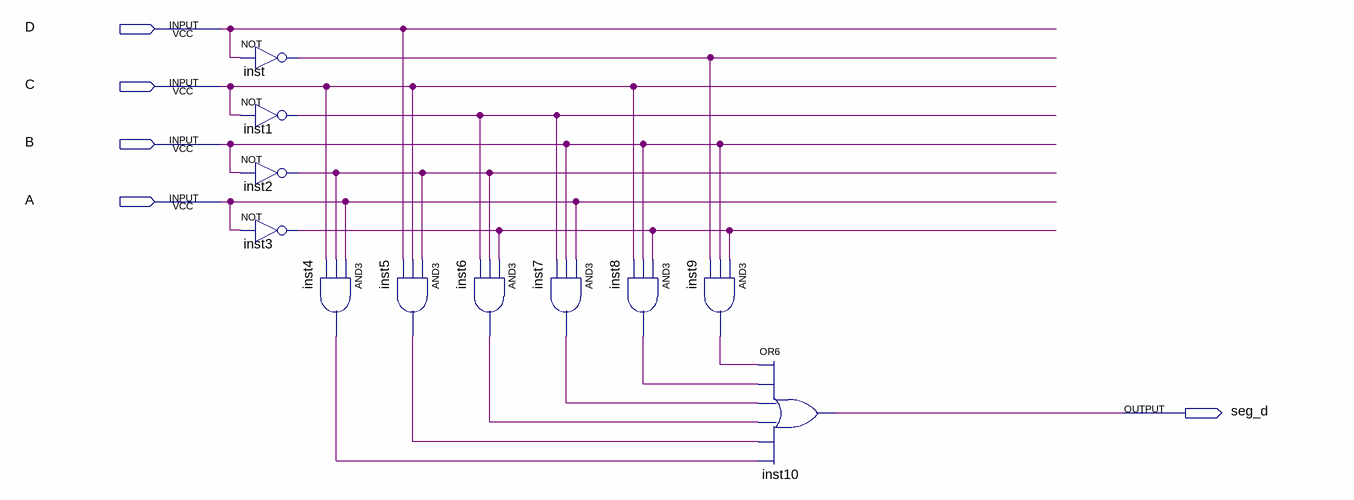
[diagram p0: schematic sheet]
// Quartus schematic seg_d.bdf as structural Verilog: 11 symbols, 5 pins
module seg_d (
  input  D,
  input  C,
  input  B,
  input  A,
  output seg_d
);

  wire inst1_out, inst2_out, inst3_out, inst4_out, inst5_out, inst6_out, inst7_out, inst8_out, inst9_out,
       inst_out;

  not inst (inst_out, D);
  not inst1 (inst1_out, C);
  not inst2 (inst2_out, B);
  not inst3 (inst3_out, A);
  and inst4 (inst4_out, A, inst2_out, C);
  and inst5 (inst5_out, inst2_out, C, D);
  and inst6 (inst6_out, inst3_out, inst2_out, inst1_out);
  and inst7 (inst7_out, A, B, inst1_out);
  and inst8 (inst8_out, inst3_out, B, C);
  and inst9 (inst9_out, inst3_out, B, inst_out);
  or inst10 (seg_d, inst9_out, inst8_out, inst7_out, inst6_out, inst5_out, inst4_out);
endmodule
